# Altium schematic sheet cSLIM-SA_power.SchDoc: cSLIM v1 - Power
size A4; SheetNumber: 7; SheetTotal: 12
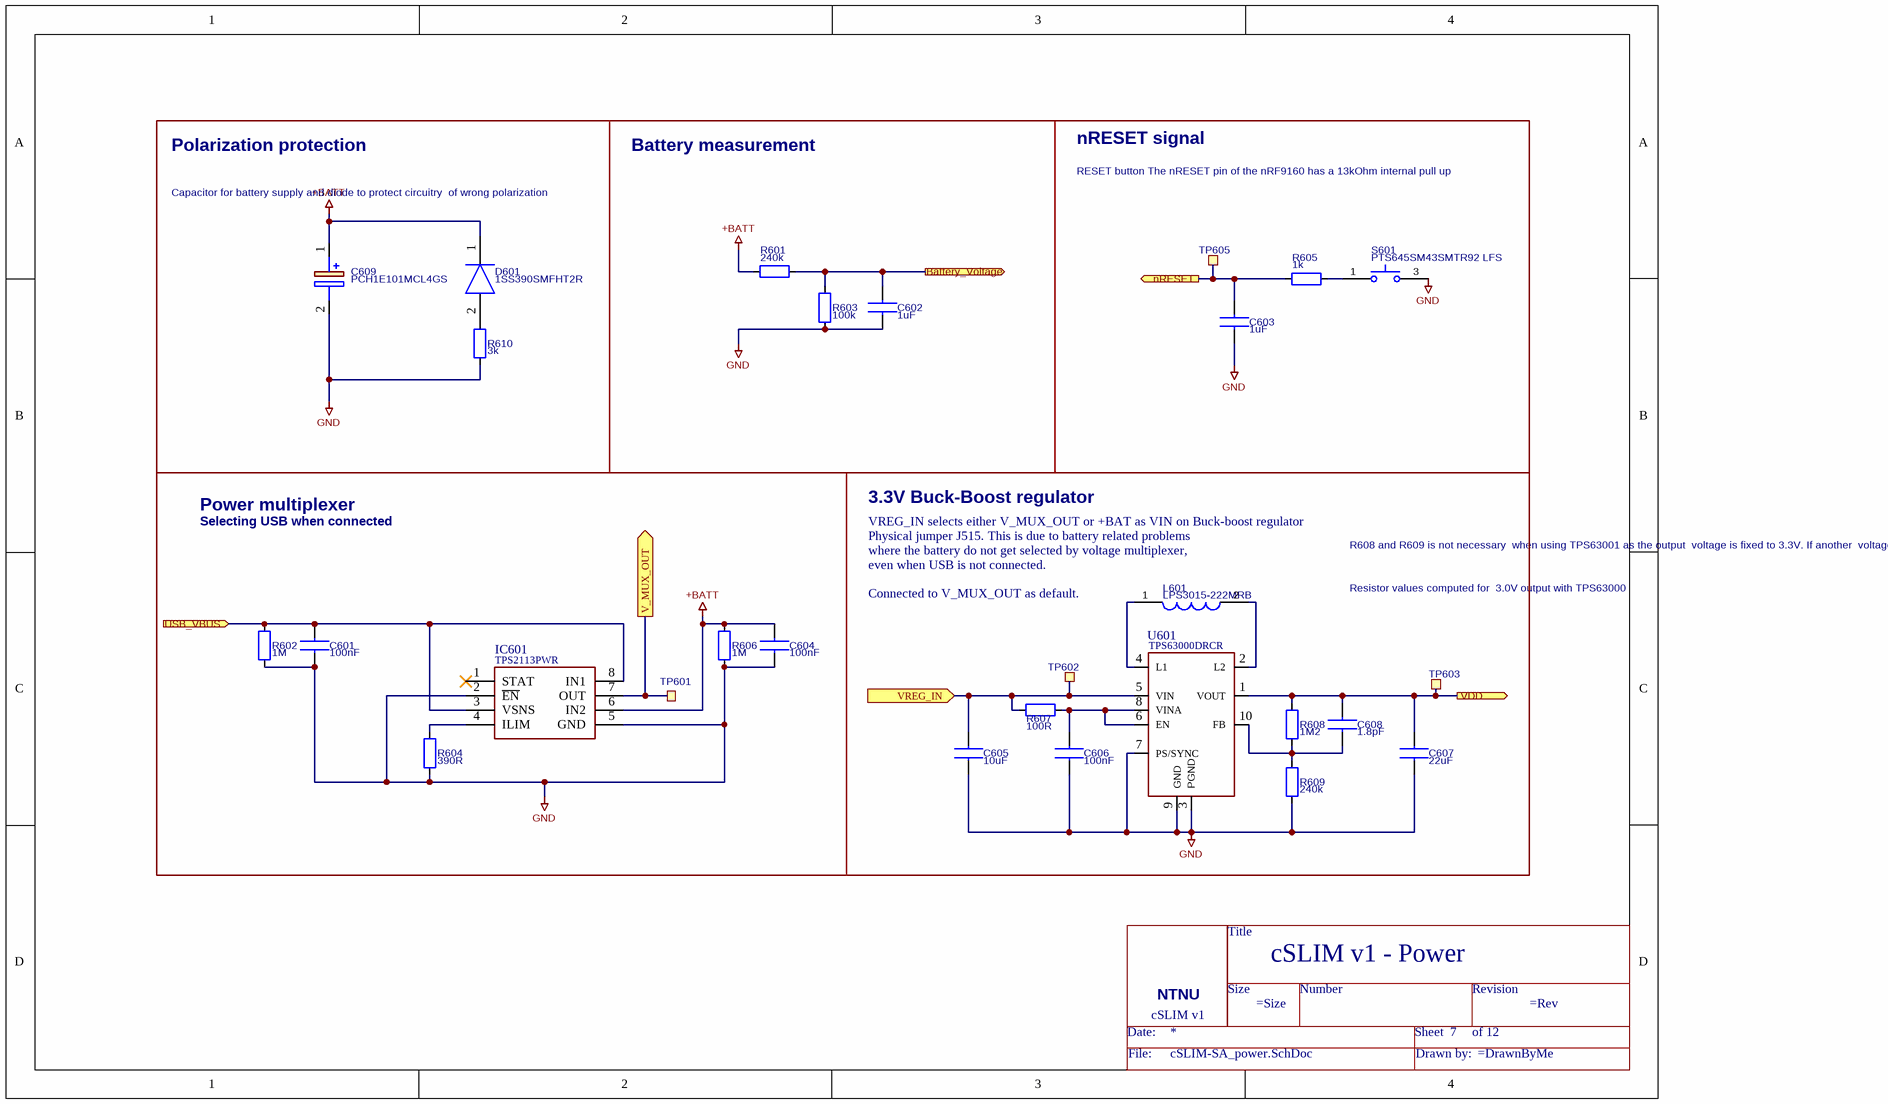
[diagram p0: cSLIM-SA_power.SchDoc]

## Parts
=DocumentName  Title_block  (value not drawn)  (no BOM)
C601  100nF  [CAPC1608X90N]
C602  1uF  [CAPC1608X90N]
C603  1uF  [CAPC1608X90N]
C604  100nF  [CAPC1608X90N]
C605  10uF  [CAPC1608X90N]
C606  100nF  [CAPC1608X90N]
C607  22uF  [CAPC1608X90N]
C608  1.8pF  [CAPC1608X90N]
C609  PCH1E101MCL4GS  [CAPAE660X840N]
D601  1SS390SMFHT2R  [SODFL1608X70N]
IC601  TPS2113PWR  [SOP65P640X120-8N]
L601  LPS3015-222MRB  [LPS3015]
R601  240k  [RESC1608X55N]
R602  1M  [RESC1608X55N]
R603  100k  [RESC1608X55N]
R604  390R  [RESC1608X55N]
R605  1k  [RESC1608X55N]
R606  1M  [RESC1608X55N]
R607  100R  [RESC1608X55N]
R608  1M2  [RESC1608X55N]
R609  240k  [RESC1608X55N]
R610  3k  [RESC1608X55N]
S601  PTS645SM43SMTR92 LFS  [PTS645(SMT)]
TP601  TP  [TP_SMD_Ø1.0mm]  (value not drawn)  (no BOM)
TP602  TP  [TP_SMD_Ø1.0mm]  (value not drawn)  (no BOM)
TP603  TP  [TP_SMD_Ø1.0mm]  (value not drawn)  (no BOM)
TP605  TP  [TP_SMD_Ø1.0mm]  (value not drawn)  (no BOM)
U601  TPS63000DRCR  [TPS63002DRCR]

## Ports
Battery_Voltage (out), nRESET (out), USB_VBUS (in), V_MUX_OUT (out), VDD (out), VREG_IN (in)

## Nets
+BATT: C604.1 C609.1(+) D601.1(K) IC601.6(IN2) R601.2 R606.1
GND: C601.2 C602.2 C603.2 C604.2 C605.2 C606.2 C607.2 C609.2(-) IC601.2(~{EN}) IC601.5(GND) R602.2 R603.2 R604.2 R606.2 R609.2 R610.2 S601.3 U601.3(PGND) U601.7(PS/SYNC) U601.9(GND)
Battery_Voltage: C602.1 R601.1 R603.1 ; port Battery_Voltage
nRESET: C603.1 R605.1 TP605.1 ; port nRESET
USB_VBUS: C601.1 IC601.3(VSNS) IC601.8(IN1) R602.1 ; port USB_VBUS
V_MUX_OUT: IC601.7(OUT) TP601.1 ; port V_MUX_OUT
VDD: C607.1 C608.1 R608.1 TP603.1 U601.1(VOUT) ; port VDD
VREG_IN: C605.1 R607.2 TP602.1 U601.5(VIN) ; port VREG_IN
NetC606_1: C606.1 R607.1 U601.6(EN) U601.8(VINA)
NetC608_2: C608.2 R608.2 R609.1 U601.10(FB)
NetD601_2: D601.2(A) R610.1
NetIC601_4: IC601.4(ILIM) R604.1
NetL601_1: L601.1 U601.4(L1)
NetL601_2: L601.2 U601.2(L2)
NetR605_2: R605.2 S601.1

Not connected (* = marked no-connect by the designer): IC601 1(STAT)*

## Notes on the sheet
- Polarization protection
- Battery measurement
- RESET button
  The nRESET pin of the nRF9160 has a 13kOhm internal pull up
- nRESET signal
- Capacitor for battery supply
  and diode to protect circuitry
  of wrong polarization
- Selecting USB when connected
- Power multiplexer
- 3.3V Buck-Boost regulator
- VREG_IN selects either V_MUX_OUT or +BAT as VIN on Buck-boost regulator
- Physical jumper J515. This is due to battery related problems
- (near L601) where the battery do not get selected by voltage multiplexer,
- R608 and R609 is not necessary
  when using TPS63001 as the output
  voltage is fixed to 3.3V. If another
  voltage is required use TPS63000
  with appropriate resistor values
- even when USB is not connected.
- Connected to V_MUX_OUT as default.
- Resistor values computed for
  3.0V output with TPS63000
- 1
- 2
- 3
- 4
- 5
- 6
- A
- B
- C
- Eivind Jølsgard
- D
- Title: cSLIM Power
- File: cSLIM_power.sch
- Sheet: /
- NTNU
- KiCad E.D.A.  kicad (5.1.4)-1
- Size: A4
- Date: 2021-03-31
- Rev: v1
- Id: 6/11
- (in symbol Title_block) Title; Size; Number; Revision; NTNU; cSLIM v1; Date:; Sheet; of; File:; Drawn by:

## Library data of the parts
C601 C604 C606 = C: Capacitor; Manufacturer_Part_Number: CL10B104KB8NNNL; Fitted: Yes; value: 100nF
C602 C603 = C: Capacitor; Manufacturer_Part_Number: CL10A105KO8NNNC; Fitted: Yes; value: 1uF
C605 = C: Capacitor; Manufacturer_Part_Number: CL10X106MP8NRNC; Fitted: Yes; value: 10uF
C607 = C: Capacitor; Manufacturer_Part_Number: CL10A226KQ8NRNE; Fitted: Yes; value: 22uF
C608 = C: Capacitor; Manufacturer_Part_Number: CL10C1R8BB8NNNC; Fitted: Yes; value: 1.8pF
C609 = PCH1E101MCL4GS: Aluminium Organic Polymer Capacitors 100UF 25V ESR=27; Manufacturer_Name: Nichicon; Fitted: Yes; Datasheet Link: https://componentsearchengine.com/Datasheets/2/PCH1E101MCL4GS.pdf; Height: 8.4mm; Manufacturer_Part_Number: PCH1E101MCL4GS; Mouser Part Number: 647-PCH1E101MCL4GS; Mouser Price/Stock: https://www.mouser.co.uk/ProductDetail/Nichicon/PCH1E101MCL4GS?qs=vmHwEFxEFR%252Bar6ugXaASOA%3D%3D
D601 = 1SS390SMFHT2R: RF Diode PIN - Single 35V 100 mA EMD2; Manufacturer_Name: ROHM Semiconductor; Fitted: Yes; Height: 0.7mm; Mouser Part Number: 755-1SS390SMFHT2R; Mouser Price/Stock: https://www.mouser.co.uk/ProductDetail/ROHM-Semiconductor/1SS390SMFHT2R?qs=0lSvoLzn4L%2FO2HkvK5CJsQ%3D%3D; Manufacturer_Part_Number: 1SS390SMFHT2R; Datasheet Link: https://componentsearchengine.com/Datasheets/2/1SS390SMFHT2R.pdf
IC601 = TPS2113PWR: OR Controller Source Selector Switch N-Channel 2:1 8-TSSOP; Manufacturer_Name: Texas Instruments; Fitted: Yes; Datasheet Link: http://www.ti.com/lit/ds/symlink/tps2113.pdf; Height: 1.2mm; Manufacturer_Part_Number: TPS2113PWR; Mouser Part Number: 595-TPS2113PWR; Mouser Price/Stock: https://www.mouser.co.uk/ProductDetail/Texas-Instruments/TPS2113PWR?qs=ojKcPFmCWSUJzuMPtPVtlA%3D%3D; Arrow Part Number: TPS2113PWR; Arrow Price/Stock: https://www.arrow.com/en/products/tps2113pwr/texas-instruments
L601 = LPS3015-103MRB: Fitted: Yes; Manufacturer_Part_Number: LPS3015-222MRB
R601 R609 = R: Manufacturer_Part_Number: RC0603FR-07240KL; Fitted: Yes; value: 240k
R602 R606 = R: Manufacturer_Part_Number: RC0603FR-131ML; Fitted: Yes; value: 1M
R603 = R: Manufacturer_Part_Number: RC0603FR-07100KL; Fitted: Yes; value: 100k
R604 = R: Manufacturer_Part_Number: RC0603JR-07390RL; Fitted: Yes; value: 390R
R605 = R: Manufacturer_Part_Number: RC0603FR-071KL; Fitted: Yes; value: 1k
R607 = R: Manufacturer_Part_Number: RC0603FR-07100RL; Fitted: Yes; value: 100R
R608 = R: Manufacturer_Part_Number: RC0603FR-071M2L; Fitted: Yes; value: 1M2
R610 = R: Manufacturer_Part_Number: RC0603FR-073KL; Fitted: Yes; value: 3k
S601 = PTS645SM43SMTR92LFS: SWITCH TACTILE SPST-NO 0.05A 12V -  used 1-3 (2-4 not in use); Manufacturer_Name: C & K COMPONENTS; Manufacturer_Part_Number: TLS A 070J LFS; Description_: Tactile Switches Top actuated tact, 0.9 mm travel, 7 N, 50% Tactile, J Leads, SMT, 8.6 x 8.4 x 3.95 mm, Soft Actuator; Fitted: Yes; Footprint: TLSA070JLFS; Supplier: https://www.mouser.ph/datasheet/2/60/tls-1846606.pdf; Mouser Part Number: 611-TLSA070JLFS; Mouser Price/Stock: https://www.mouser.co.uk/ProductDetail/CK/TLS-A-070J-LFS?qs=GedFDFLaBXEdAqJ422mDcw%3D%3D
TP601-TP603 TP605 = TP: Test points
U601 = TPS63000DRCR: Buck-Boost Switching Regulator IC Positive Adjustable 1.2V 1 Output 1.6A (Switch) 10-VFDFN Exposed Pad; Manufacturer_Name: Texas Instruments; Fitted: Yes; Datasheet Link: https://www.ti.com/lit/ds/symlink/tps63000.pdf?HQS=ti-null-null-sf-df-pf-sep-wwe&ts=1593405994673; Height: 1mm; Manufacturer_Part_Number: TPS63000DRCR; Mouser Part Number: 595-TPS63000DRCR; Mouser Price/Stock: https://www.mouser.co.uk/ProductDetail/Texas-Instruments/TPS63000DRCR?qs=QZuYiDxzHaj%2FxB6t44u%252B6Q%3D%3D; Arrow Part Number: TPS63000DRCR; Arrow Price/Stock: https://www.arrow.com/en/products/tps63000drcr/texas-instruments?region=nac